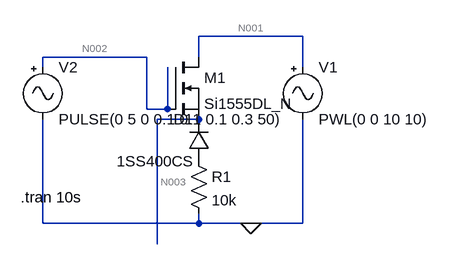
[diagram p0: schematic Draft1.asc]
Draft1.asc, the LTspice schematic file:
Version 4
SHEET 1 880 680
WIRE 320 32 160 32
WIRE 80 64 -80 64
WIRE 160 64 160 32
WIRE -80 80 -80 64
WIRE 320 80 320 32
WIRE 80 144 80 64
WIRE 112 144 112 80
WIRE 112 144 80 144
WIRE 160 160 96 160
WIRE -80 320 -80 160
WIRE 160 320 160 304
WIRE 160 320 -80 320
WIRE 240 320 160 320
WIRE 320 320 320 160
WIRE 320 320 240 320
WIRE 96 352 96 160
FLAG 240 320 0
SYMBOL nmos 112 64 R0
SYMATTR InstName M1
SYMATTR Value Si1555DL_N
SYMBOL Misc\\signal 320 64 R0
WINDOW 123 0 0 Left 0
WINDOW 39 0 0 Left 0
SYMATTR InstName V1
SYMATTR Value PWL(0 0 10 10)
SYMBOL Misc\\signal -80 64 R0
WINDOW 123 0 0 Left 0
WINDOW 39 0 0 Left 0
SYMATTR InstName V2
SYMATTR Value PULSE(0 5 0 0.1 0.1 0.1 0.3 50)
SYMBOL res 144 208 R0
SYMATTR InstName R1
SYMATTR Value 10k
SYMBOL diode 176 224 R180
WINDOW 0 24 64 Left 2
WINDOW 3 24 0 Left 2
SYMATTR InstName D1
SYMATTR Value 1SS400CS
TEXT -114 280 Left 2 !.tran 10s

The netlist it stands for:
* Draft1.asc
M1 N001 N002 N003 N003 Si1555DL_N
V1 N001 0 PWL(0 0 10 10)
V2 N002 0 PULSE(0 5 0 0.1 0.1 0.1 0.3 50)
R1 P001 0 10k
D1 P001 N003 1SS400CS
.model D D
.lib standard.dio
.model NMOS NMOS
.model PMOS PMOS
.lib standard.mos
.tran 10s
.backanno
.end

* Results of the author's LTspice run, read from the files saved beside the schematic
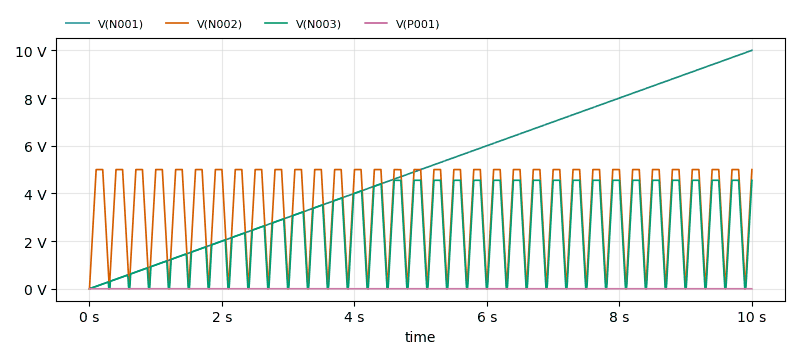
[diagram p1: Transient Analysis of Draft1.asc, plotted from the saved traces]
* Transient Analysis, 1 run:
*   V(N001): min 0 V, max 10 V, average 5 V, rms 5.774 V, last 10 V
*   V(N002): min 0 V, max 5 V, average 3.325 V, rms 3.845 V, last 5 V
*   V(N003): min -1.291 mV, max 4.55 V, average 2.336 V, rms 2.959 V, last 4.55 V
*   V(P001): min -5.242 µV, max 225.9 µV, average 206.2 µV, rms 212.1 µV, last 225.9 µV